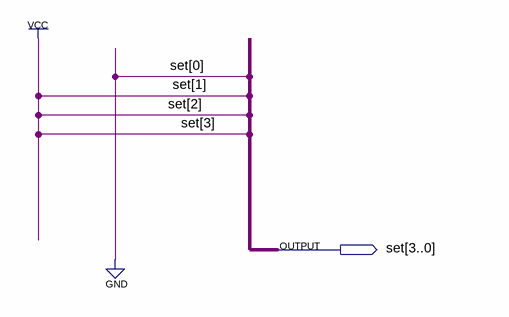
[diagram p0: schematic sheet]
// Quartus schematic num_4b_14d.bdf as structural Verilog: 0 symbols, 1 pins
module num_4b_14d (
  output [3:0] set
);


  assign set = 4'b1110;
endmodule
